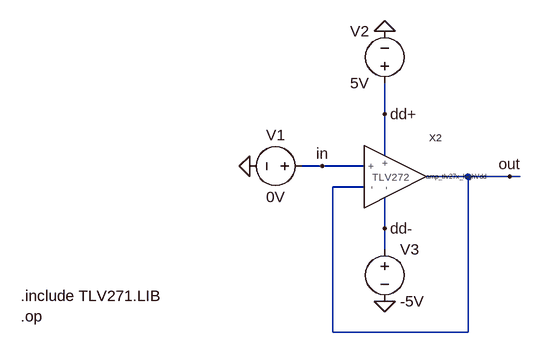
[diagram p0: schematic Exercise4.asc]
Exercise4.asc, the LTspice schematic file:
Version 4.1
SHEET 1 880 680
WIRE 176 -16 176 -64
WIRE 176 48 176 -16
WIRE 80 64 48 64
WIRE 144 64 80 64
WIRE 304 80 240 80
WIRE 368 80 304 80
WIRE 384 80 368 80
WIRE 144 96 96 96
WIRE 176 160 176 112
WIRE 176 192 176 160
WIRE 96 320 96 96
WIRE 304 320 304 80
WIRE 304 320 96 320
FLAG -32 64 0
FLAG 80 64 in
FLAG 368 80 out
FLAG 176 -144 0
FLAG 176 -16 dd+
FLAG 176 160 dd-
FLAG 176 272 0
SYMBOL EEL3111C\\amp_tlv27x_highVdd 240 80 R0
WINDOW 3 0 0 Left 0
SYMATTR Value amp_tlv27x_highVdd
SYMATTR InstName X2
SYMATTR Prefix X
SYMBOL voltage 64 64 R90
WINDOW 0 -32 56 VBottom 2
WINDOW 3 32 56 VTop 2
WINDOW 123 0 0 Left 0
WINDOW 39 0 0 Left 0
SYMATTR InstName V1
SYMATTR Value 0V
SYMBOL voltage 176 -48 R180
WINDOW 0 24 96 Left 2
WINDOW 3 24 16 Left 2
WINDOW 123 0 0 Left 0
WINDOW 39 0 0 Left 0
SYMATTR InstName V2
SYMATTR Value 5V
SYMBOL voltage 176 176 R0
WINDOW 123 0 0 Left 0
WINDOW 39 0 0 Left 0
SYMATTR InstName V3
SYMATTR Value -5V
TEXT -384 264 Left 2 !.include TLV271.LIB\n.op

The netlist it stands for:
* Exercise4.asc
X§X2 out in dd+ dd- out amp_tlv27x_highVdd params: amp_tlv27x_highVdd  ; pins 1 2 3 4 5
V1 in 0 0V
V2 dd+ 0 5V
V3 dd- 0 -5V
.include TLV271.LIB
.op
.backanno
.end

* Results of the author's LTspice run, read from the files saved beside the schematic
* Operating Point:
*   V(dd+) = 5 V
*   V(dd-) = -5 V
*   V(in) = 0 V
*   V(out) = 5.001 V
*   I(V1) = 10.91 pA
*   I(V2) = 14.68 mA
*   I(V3) = 67.78 µA
*   Ix(x2:1) = 27.89 pA
*   Ix(x2:2) = -10.91 pA
*   Ix(x2:3) = -14.68 mA
*   Ix(x2:4) = -67.78 µA
*   Ix(x2:5) = -27.24 pA